# Altium schematic sheet TaxoOut.SchDoc
size A4; Organization: Altium Limited; Address1: L3, 12a Rodborough Rd; Address2: Frenchs Forest; Address3: NSW; Address4: Australia 2086
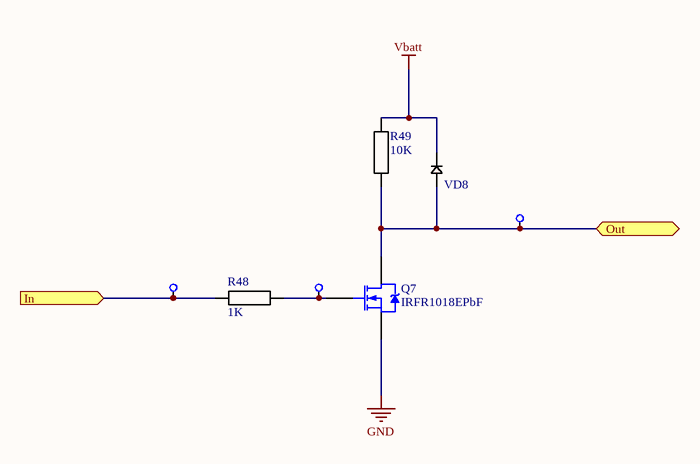
[diagram p0: TaxoOut.SchDoc]

## Parts
Q7  IRFR1018EPbF  [DPAK228P991X238-3M]
R48  1K  [SMD 0603]
R49  10K  [SMD 0603]
TP66  TestPoint  [TESTPOINT]  (value not drawn)
TP67  TestPoint  [TESTPOINT]  (value not drawn)
TP68  TestPoint  [TESTPOINT]  (value not drawn)
VD8  Diode  [DO-214AA]  (value not drawn)

## Ports
In (in), Out (bidir)

## Nets
GND: Q7.3(S)
Vbatt: R49.2 VD8.1
In: R48.2 TP66.0 ; port In
Out: Q7.4(D) R49.1 TP68.0 VD8.0 ; port Out
NetQ7_1: Q7.1(G) R48.1 TP67.0

## Notes on the sheet
- Title
- Size:
- Date:
- A4
- Number:
- Time:
- Revision:
- Sheet
- of
- File:

## Library data of the parts
Q7 = IRFR1018EPbF: HEXFET Power MOSFET; ComponentLink1Description: datasheet; ComponentLink1URL: https://data.electronshik.ru/z/Datasheet/I/IRFR1018EPBF.pdf
R48 = Resistor: RC0603FR-071KL; Value: 1K
R49 = Resistor: RC0603FR-0710KL; Value: 10K
VD8 = Diode: STTH4R02U 200 V, 4 A High Effiency Ultrafast Diode; ComponentLink1Description: Datashit; ComponentLink1URL: https://www.st.com/resource/en/datasheet/stth4r02.pdf